# EAGLE design Lighting (EAGLE 9.6.2)
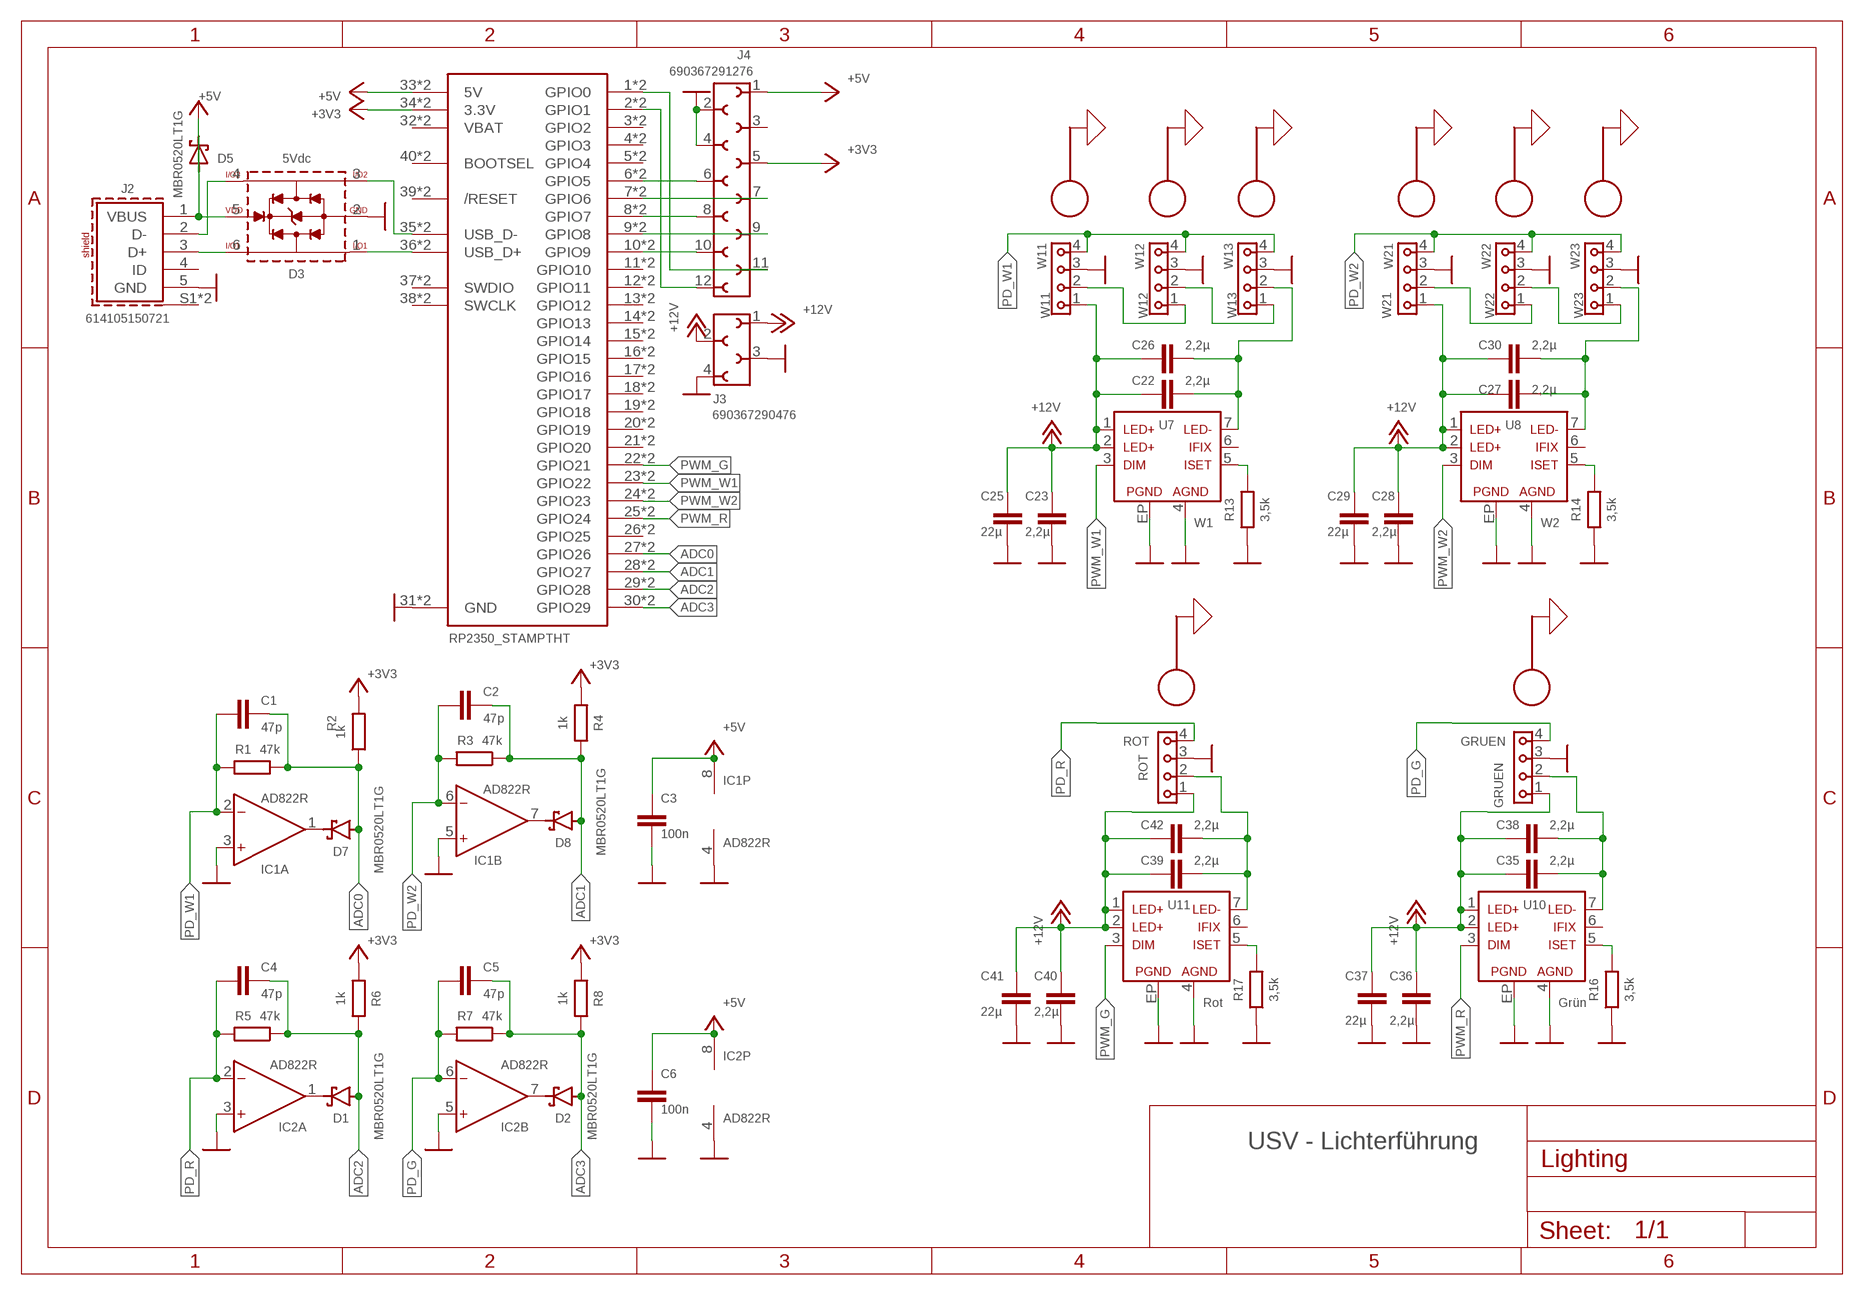
[diagram p0: schematic, sheet 1]

## Parts
C1  47p  C_CHIP-0805(2012-METRIC)  [CAPC2012X110]
C2  47p  C_CHIP-0805(2012-METRIC)  [CAPC2012X110]
C3  100n  C_CHIP-0805(2012-METRIC)  [CAPC2012X110]
C4  47p  C_CHIP-0805(2012-METRIC)  [CAPC2012X110]
C5  47p  C_CHIP-0805(2012-METRIC)  [CAPC2012X110]
C6  100n  C_CHIP-0805(2012-METRIC)  [CAPC2012X110]
C22  2,2µ  C_CHIP-0805(2012-METRIC)  [CAPC2012X110]
C23  2,2µ  C_CHIP-0805(2012-METRIC)  [CAPC2012X110]
C25  22µ  C_CHIP-0805(2012-METRIC)  [CAPC2012X110]
C26  2,2µ  C_CHIP-0805(2012-METRIC)  [CAPC2012X110]
C27  2,2µ  C_CHIP-0805(2012-METRIC)  [CAPC2012X110]
C28  2,2µ  C_CHIP-0805(2012-METRIC)  [CAPC2012X110]
C29  22µ  C_CHIP-0805(2012-METRIC)  [CAPC2012X110]
C30  2,2µ  C_CHIP-0805(2012-METRIC)  [CAPC2012X110]
C35  2,2µ  C_CHIP-0805(2012-METRIC)  [CAPC2012X110]
C36  2,2µ  C_CHIP-0805(2012-METRIC)  [CAPC2012X110]
C37  22µ  C_CHIP-0805(2012-METRIC)  [CAPC2012X110]
C38  2,2µ  C_CHIP-0805(2012-METRIC)  [CAPC2012X110]
C39  2,2µ  C_CHIP-0805(2012-METRIC)  [CAPC2012X110]
C40  2,2µ  C_CHIP-0805(2012-METRIC)  [CAPC2012X110]
C41  22µ  C_CHIP-0805(2012-METRIC)  [CAPC2012X110]
C42  2,2µ  C_CHIP-0805(2012-METRIC)  [CAPC2012X110]
D1  MBR0520LT1G  SCHOTTKY_MBR0520LT1GDO-219  [SODFL3718X115]
D2  MBR0520LT1G  SCHOTTKY_MBR0520LT1GDO-219  [SODFL3718X115]
D3  5Vdc  WE-TVS-HS_SOT563_82400152  [WE-TVS_SOT563]
D5  MBR0520LT1G  SCHOTTKY_MBR0520LT1GDO-219  [SODFL3718X115]
D7  MBR0520LT1G  SCHOTTKY_MBR0520LT1GDO-219  [SODFL3718X115]
D8  MBR0520LT1G  SCHOTTKY_MBR0520LT1GDO-219  [SODFL3718X115]
GRUEN  LED_PLATINE  [LED_PLATINE]
IC1  AD822R  [SO8]
IC2  AD822R  [SO8]
J2  614105150721  [614105150721]
J3  690367290476  [690367290476]
J4  690367291276  [690367291276]
R1  47k  R_CHIP-0805(2012-METRIC)  [RESC2012X65]
R2  1k  R_CHIP-0805(2012-METRIC)  [RESC2012X65]
R3  47k  R_CHIP-0805(2012-METRIC)  [RESC2012X65]
R4  1k  R_CHIP-0805(2012-METRIC)  [RESC2012X65]
R5  47k  R_CHIP-0805(2012-METRIC)  [RESC2012X65]
R6  1k  R_CHIP-0805(2012-METRIC)  [RESC2012X65]
R7  47k  R_CHIP-0805(2012-METRIC)  [RESC2012X65]
R8  1k  R_CHIP-0805(2012-METRIC)  [RESC2012X65]
R13  3,5k  R_CHIP-0805(2012-METRIC)  [RESC2012X65]
R14  3,5k  R_CHIP-0805(2012-METRIC)  [RESC2012X65]
R16  3,5k  R_CHIP-0805(2012-METRIC)  [RESC2012X65]
R17  3,5k  R_CHIP-0805(2012-METRIC)  [RESC2012X65]
ROT  LED_PLATINE  [LED_PLATINE]
U7  W1  MAGI³C-LDHM_172946001  [MAGI³C-LDHM_172946001]
U8  W2  MAGI³C-LDHM_172946001  [MAGI³C-LDHM_172946001]
U10  Grün  MAGI³C-LDHM_172946001  [MAGI³C-LDHM_172946001]
U11  Rot  MAGI³C-LDHM_172946001  [MAGI³C-LDHM_172946001]
U$1  RP2350_STAMPTHT  [RP2XXX_STAMP_TH]
W11  LED_PLATINE  [LED_PLATINE]
W12  LED_PLATINE  [LED_PLATINE]
W13  LED_PLATINE  [LED_PLATINE]
W21  LED_PLATINE  [LED_PLATINE]
W22  LED_PLATINE  [LED_PLATINE]
W23  LED_PLATINE  [LED_PLATINE]

## Nets
+3V3: J4.5 R2.2 R4.2 R6.2 R8.2 U$1.34(3.3V) U$1.TH34(3.3V)
+5V: C3.1 C6.1 D5.2(A) IC1.8(P:V+) IC2.8(P:V+) J4.1 U$1.33(5V) U$1.TH33(5V)
+12V: C22.1 C23.1 C25.1 C26.1 C27.1 C28.1 C29.1 C30.1 C35.1 C36.1 C37.1 C38.1 C39.1 C40.1 C41.1 C42.1 GRUEN.1 J3.1 J3.2 ROT.1 U7.1(LED+) U7.2(LED1+) U8.1(LED+) U8.2(LED1+) U10.1(LED+) U10.2(LED1+) U11.1(LED+) U11.2(LED1+) W11.1 W21.1
ADC0: C1.2 D7.2(A) R1.1 R2.1 U$1.27(GPIO26) U$1.TH27(GPIO26)
ADC1: C2.2 D8.2(A) R3.1 R4.1 U$1.28(GPIO27) U$1.TH28(GPIO27)
ADC2: C4.2 D1.2(A) R5.1 R6.1 U$1.29(GPIO28) U$1.TH29(GPIO28)
ADC3: C5.2 D2.2(A) R7.1 R8.1 U$1.30(GPIO29) U$1.TH30(GPIO29)
D+@1: D3.6(I/O3) J2.3(D+)
D-@1: D3.4(I/O4) J2.2(D-)
D_N: D3.3(I/O2) U$1.35(USB_D-) U$1.TH35(USB_D-)
D_P: D3.1(I/O1) U$1.36(USB_D+) U$1.TH36(USB_D+)
GND: C3.2 C6.2 C23.2 C25.2 C28.2 C29.2 C36.2 C37.2 C40.2 C41.2 D3.2(GND) GRUEN.3 IC1.3(A:IN+) IC1.4(P:V-) IC1.5(B:IN+) IC2.3(A:IN+) IC2.4(P:V-) IC2.5(B:IN+) J2.5(GND) J3.3 J3.4 J4.2 J4.4 R13.1 R14.1 R16.1 R17.1 ROT.3 U7.4(AGND) U7.EP(PGND) U8.4(AGND) U8.EP(PGND) U10.4(AGND) U10.EP(PGND) U11.4(AGND) U11.EP(PGND) U$1.31(GND) U$1.TH31(GND) W11.3 W12.3 W13.3 W21.3 W22.3 W23.3
LED-G-: C35.2 C38.2 GRUEN.2 U10.7(LED-)
LED-R-: C39.2 C42.2 ROT.2 U11.7(LED-)
LED-W1-: C22.2 C26.2 U7.7(LED-) W13.2
LED_W2-: C27.2 C30.2 U8.7(LED-) W23.2
N$1: D1.1(C) IC2.1(A:OUT)
N$2: D2.1(C) IC2.7(B:OUT)
N$4: J4.10 U$1.10(GPIO9) U$1.TH10(GPIO9)
N$5: D7.1(C) IC1.1(A:OUT)
N$6: J4.9 U$1.9(GPIO8) U$1.TH9(GPIO8)
N$11: J4.8 U$1.8(GPIO7) U$1.TH8(GPIO7)
N$12: J4.7 U$1.7(GPIO6) U$1.TH7(GPIO6)
N$13: D8.1(C) IC1.7(B:OUT)
N$14: J4.6 U$1.6(GPIO5) U$1.TH6(GPIO5)
N$17: R16.2 U10.5(ISET)
N$18: R17.2 U11.5(ISET)
N$20: R13.2 U7.5(ISET)
N$21: J4.12 U$1.2(GPIO1) U$1.TH2(GPIO1)
N$22: J4.11 U$1.1(GPIO0) U$1.TH1(GPIO0)
N$25: R14.2 U8.5(ISET)
PD_G: C5.1 GRUEN.4 IC2.6(B:IN-) R7.2
PD_R: C4.1 IC2.2(A:IN-) R5.2 ROT.4
PD_W1: C1.1 IC1.2(A:IN-) R1.2 W11.4 W12.4 W13.4
PD_W2: C2.1 IC1.6(B:IN-) R3.2 W21.4 W22.4 W23.4
PWM_G: U11.3(DIM) U$1.22(GPIO21) U$1.TH22(GPIO21)
PWM_R: U10.3(DIM) U$1.25(GPIO24) U$1.TH25(GPIO24)
PWM_W1: U7.3(DIM) U$1.23(GPIO22) U$1.TH23(GPIO22)
PWM_W2: U8.3(DIM) U$1.24(GPIO23) U$1.TH24(GPIO23)
VBUS: D3.5(VDD) D5.1(C) J2.1(VBUS)
W11_W12: W11.2 W12.1
W12_W13: W12.2 W13.1
W21_W22: W21.2 W22.1
W22_W23: W22.2 W23.1
Unconnected: GRUEN.5 J2.4(ID) J2.S1(SHIELD) J2.S2(SHIELD) J4.3 ROT.5 U7.6(IFIX) U8.6(IFIX) U10.6(IFIX) U11.6(IFIX) U$1.3(GPIO2) U$1.4(GPIO3) U$1.5(GPIO4) U$1.11(GPIO10) U$1.12(GPIO11) U$1.13(GPIO12) U$1.14(GPIO13) U$1.15(GPIO14) U$1.16(GPIO15) U$1.17(GPIO16) U$1.18(GPIO17) U$1.19(GPIO18) U$1.20(GPIO19) U$1.21(GPIO20) U$1.26(GPIO25) U$1.37(SWDIO) U$1.38(SWCLK) U$1.39(/RESET) U$1.40(BOOTSEL) U$1.TH3(GPIO2) U$1.TH4(GPIO3) U$1.TH5(GPIO4) U$1.TH11(GPIO10) U$1.TH12(GPIO11) U$1.TH13(GPIO12) U$1.TH14(GPIO13) U$1.TH15(GPIO14) U$1.TH16(GPIO15) U$1.TH17(GPIO16) U$1.TH18(GPIO17) U$1.TH19(GPIO18) U$1.TH20(GPIO19) U$1.TH21(GPIO20) U$1.TH26(GPIO25) U$1.TH37(SWDIO) U$1.TH38(SWCLK) U$1.TH39(/RESET) U$1.TH40(BOOTSEL) W11.5 W12.5 W13.5 W21.5 W22.5 W23.5

## Notes on the sheet
- USV - Lichterführung

## Power pins joined to a net without a drawn wire
VBAT: U$1.32(VBAT) U$1.TH32(VBAT)

## Library data of the parts
C1-C6 C22 C23 C25-C30 C35-C42 = Capacitor:C: Capacitor - Generic; CATEGORY: Capacitor
D1 D2 D5 D7 D8 = diode:SCHOTTKY_: Schottky Diode - Popular parts; CATEGORY: Diode; DESCRIPTION: DIODE SCHOTTKY 20V 500MA SOD123; MANUFACTURER: ON Semiconductor; MPN: MBR0520LT1G; SUB-CATEGORY: Schottky
D3 = Eagle_WE-TVS (rev22a):WE-TVS-HS_SOT563_82400152: WE-TVS TVS Diode – High Speed Series Characteristics Low clamping voltage Sturdy design Very low capacitance Flow Thru Design for a simple layout Rail to Rail protection Epoxy flame resistant UL94-V0 RoHS, REACH and free of halogens Applications Very fast data lines USB 2.0 Ethernet PoE VGA Sim Cards Keypads HS = High Speed <https://www.we-online.com/catalog/media/o14883v209%20Family_WE-TVS_HIGHSPEED.jpg> Details see: https://www.we-online.com/catalog/en/WE-TVS-HS Updated by Ella Wu 2019-07-12 2019 (C) Wurth Elektronik; C-CH: 2pF; CHANNELS: 2+1; DATASHEET-URL: https://www.we-online.com/catalog/datasheet/82400152.pdf; IPEAK: 6A; MOUNT: SMT; PART-NUMBER: 82400152; VBR: 6V
GRUEN ROT W11-W13 W21-W23 = LED_Platine_SMD:LED_PLATINE
IC1 IC2 = analog-devices:AD822: Single-Supply, Rail-to-Rail Low Power FET-Input Op Amp Source: http://www.analog.com/static/imported-files/data_sheets/AD822.pdf; MF: ANALOG DEVICES; MPN: AD822BRZ; OC_FARNELL: 1651303
J2 = Eagle_WR-USB (rev24c):614105150721: WR-COM Micro USB 2.0 Type B Vertical 5 Contacts General Information Operating Temperature -40 °C up to +85 °C Compliance RoHS Durability 10 000 Mating cycles Quality Class 10 000 Mating cycles Connector Type Micro USB Gender Receptacle Type Vertical Electrical Properties IR 1.8 A Working Voltage 30 V (AC) Withstanding Voltage 100 V (AC) Contact Resistance 30 mΩ Material Properties Insulator Material LCP Insulator Flammability Rating UL94 V-0 Color Black Contact Material Copper Alloy Contact Plating Gold Contact Type Stamped Shielding Material Stainless Steel Shielding Plating Matte Tin <https://www.we-online.com/components/media/o72645v209%20Family_WR-COM_Micro-USB-Type-B_Vertical_614105150721.jpg> Details see: www.we-online.com/en/components/products/COM_MICRO_TYPE_B_VERTICAL <www.we-online.com/catalog/COM_MICRO_TYPE_B_VERTICAL/?utm_source=eagle_model&utm_medium=description_link&utm_campaign=eisos_eagle> Updated by Ella 2024-05-21 2024 (C) Würth Elektronik; APPLICATION: Micro USB 2.0; DATASHEET-URL: https://www.we-online.com/redexpert/spec/614105150721?ae; GERDER: Receptacle; INTERFACE-TYPE: Type B; IR: 1.8A; MOUNT: THT; PACKAGING: Tape and Reel; PART-NUMBER: 614105150721; PINS: 5; TYPE: Vertical; WORKING-VOLTAGE: 30V(AC)
J3 = Eagle_WR-MM (rev20b):690367290476: WR-MM Female SMT Connector with Latch & Polarization KIND PROPERTIES: Pitch 2.54 mm Gender:Female MATERIAL PROPERTIES: Insulator Material:PA6T Insulator Flammability Rating UL94 V-0 Insulator Color:Red Contact Material :Phosphor Bronze Contact Plating :Mat Tin over Nickel Contact Type: Stamped GENERAL PROPERTIES: Operating Temperature:-40 °C up to +105 °C Compliance Lead free / RoHS ELECTRICAL PROPERTIES: Working Voltage 100 V (AC) Withstanding Voltage:500 V (AC) Contact Resistance: 10 mΩ Insulation Resistance:1000 MΩ PACKAGING PROPERTIES: cULus Approval:E323964 Packaging :Tape and Reel <https://katalog.we-online.com/media/images/v2/o33161v209%20WR-MiMo_69036729xx76.jpg> Details see: Web 1: https://katalog.we-online.com/en/em/MM_1_27_SMT_FEMALE_CONNECTOR_WITH_LATCH_AND_POLARIZATION_69036729XX76_2 Web2: https://katalog.we-online.com/en/em/MM_1_27_SMT_FEMALE_CONNECTOR_WITH_LATCH_AND_POLARIZATION_69036729XX76 Updated by Yingchun,Shan 2019-10-28 2019 (C) Würth Elektronik; DATASHEET-URL: https://www.we-online.com/catalog/datasheet/690367290476.pdf; GENDER: Female; IR: 1.5A; PACKAGING: Tape and Reel; PART-NUMBER: 690367290476; PINS: 4; PITCH: 2.54; TYPE: Straight
J4 = Eagle_WR-MM (rev20b):690367291276: WR-MM Female SMT Connector with Latch & Polarization KIND PROPERTIES: Pitch 2.54 mm Gender:Female MATERIAL PROPERTIES: Insulator Material:PA6T Insulator Flammability Rating UL94 V-0 Insulator Color:Red Contact Material :Phosphor Bronze Contact Plating :Mat Tin over Nickel Contact Type: Stamped GENERAL PROPERTIES: Operating Temperature:-40 °C up to +105 °C Compliance Lead free / RoHS ELECTRICAL PROPERTIES: Working Voltage 100 V (AC) Withstanding Voltage:500 V (AC) Contact Resistance: 10 mΩ Insulation Resistance:1000 MΩ PACKAGING PROPERTIES: cULus Approval:E323964 Packaging :Tape and Reel <https://katalog.we-online.com/media/images/v2/o33161v209%20WR-MiMo_69036729xx76.jpg> Details see: Web 1: https://katalog.we-online.com/en/em/MM_1_27_SMT_FEMALE_CONNECTOR_WITH_LATCH_AND_POLARIZATION_69036729XX76_2 Web2: https://katalog.we-online.com/en/em/MM_1_27_SMT_FEMALE_CONNECTOR_WITH_LATCH_AND_POLARIZATION_69036729XX76 Updated by Yingchun,Shan 2019-10-28 2019 (C) Würth Elektronik; DATASHEET-URL: https://www.we-online.com/catalog/datasheet/690367291276.pdf; GENDER: Female; IR: 1.5A; PACKAGING: Tape and Reel; PART-NUMBER: 690367291276; PINS: 12; PITCH: 2.54; TYPE: Straight
R1-R8 R13 R14 R16 R17 = Resistor:R: Resistor Fixed - Generic; CATEGORY: Resistor; SUB-CATEGORY: Fixed
U7 U8 U10 U11 = Eagle_MAGIC-LDHM (rev19a):MAGI³C-LDHM_172946001: MagI³C-LDHM LED Step Down High Current Module Characteristics Leaded package for easy manufacturing and prototyping Simple layout PWM and analog dimming supported Adjustable LED current Low conducted and radiated EMI (compliant to EN55015) Applications Indoor lighting: Spot light, down light Outdoor lighting: Street light, security light, tunnel light Outdoor lighting: High-bay light, low-bay light <https://katalog.we-online.de/media/images/v2/o55812v209%20Family_LED-Driver_Module_WE-LDHM_7EP.jpg> Details see: https://katalog.we-online.de/en/pm/MAGIC-LDHM-TOP263-7EP <hhttps://katalog.we-online.de/en/pm/MAGIC-LDHM-TOP263-7EP> Updated by Ella Wu, 2019-09-18 2019 (C) Würth Elektronik; DATASHEET-URL: https://katalog.we-online.de/pm/datasheet/172946001.pdf; I-OUTPUT: 450mA; MOUNT: SMT; PART-NUMBER: 172946001; V-INPUT: 4.5-60V; V-OUTPUT: 4.5-60V
U$1 = rp2xxx_stamp:RP2350_STAMP

## Board
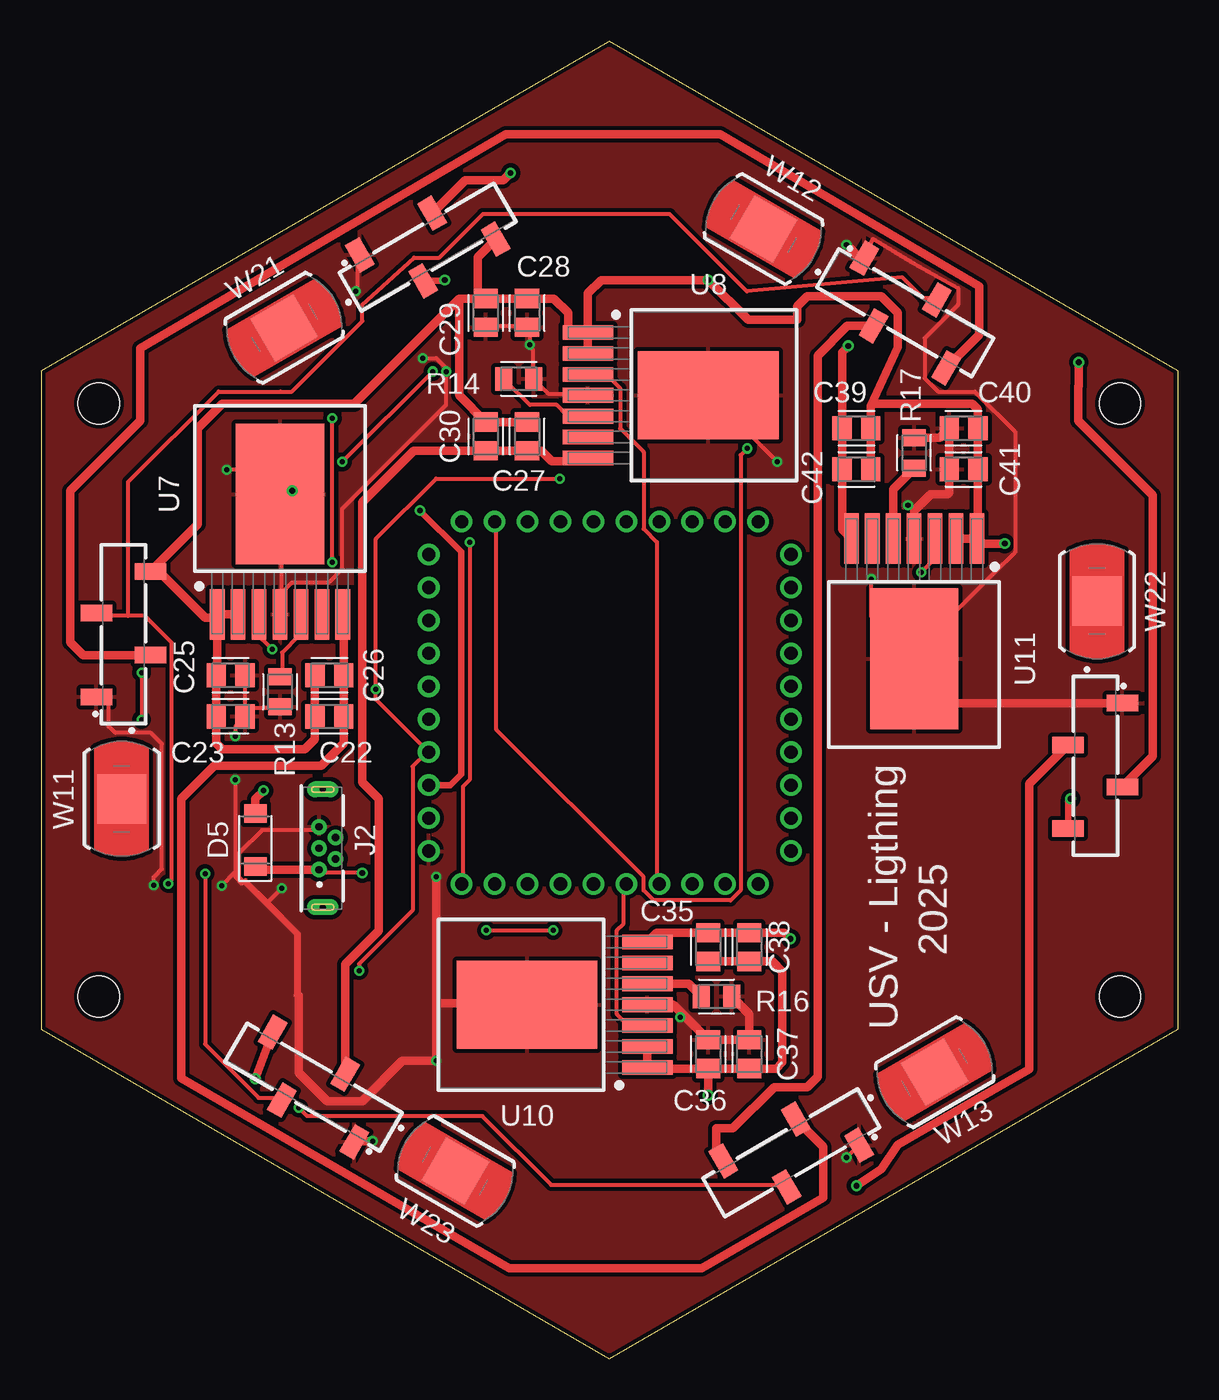
[diagram p1: board, top side]
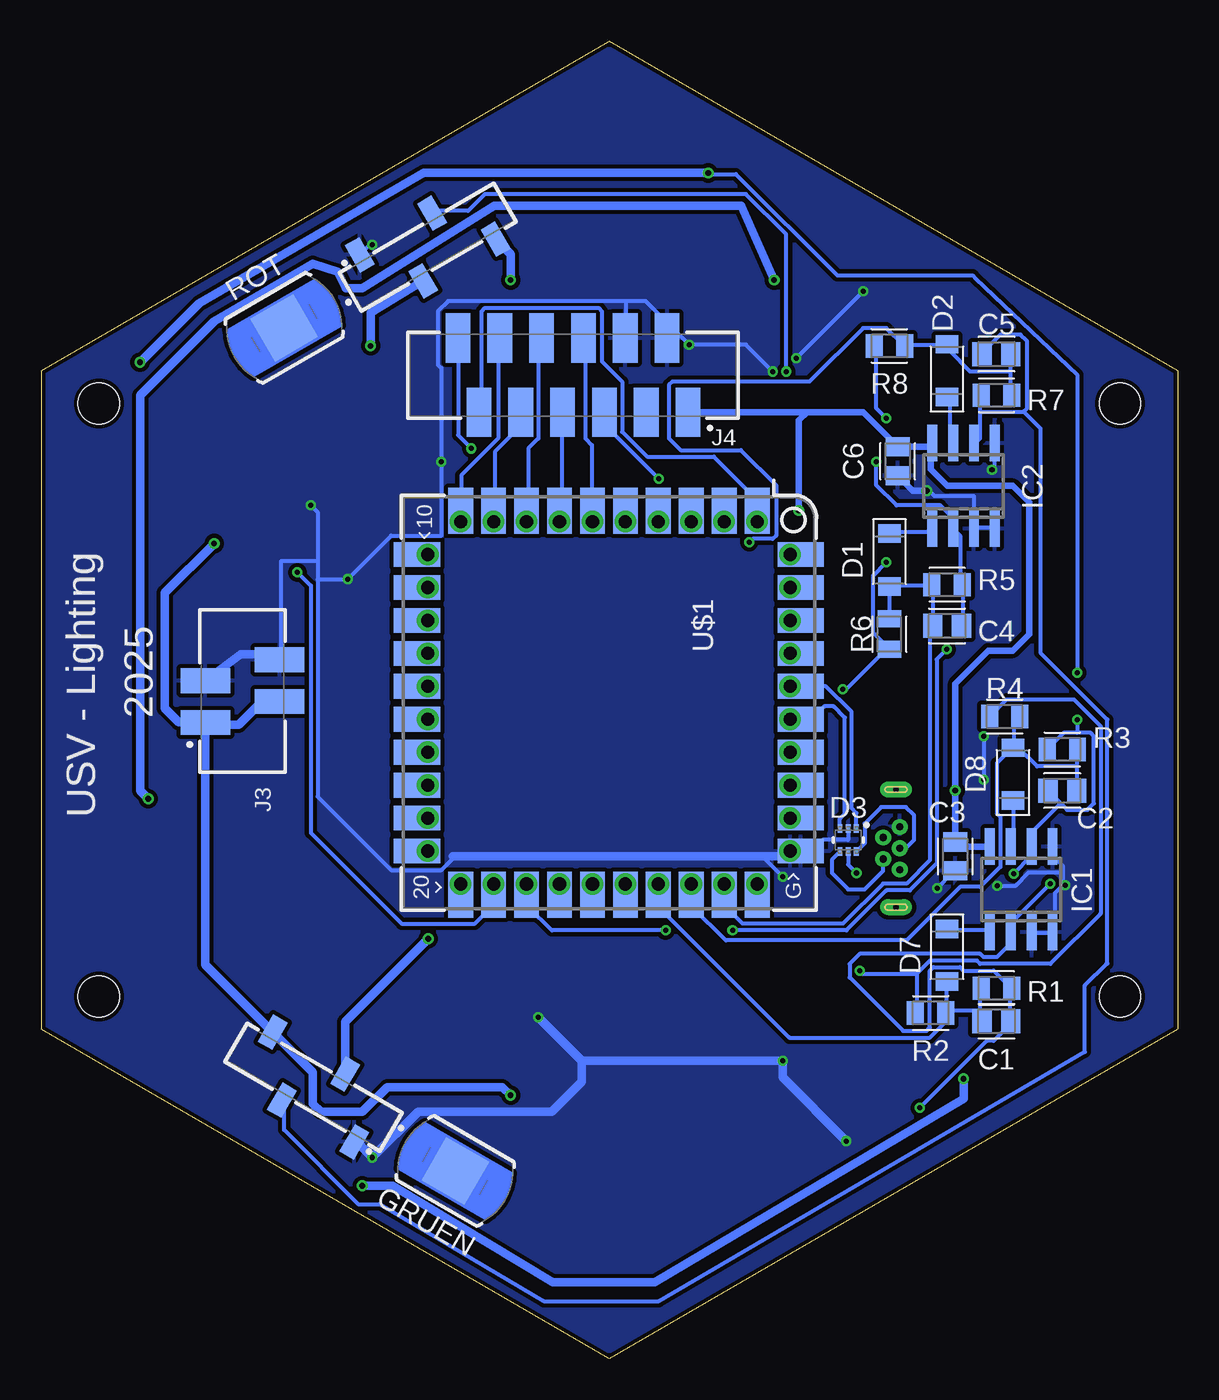
[diagram p2: board, bottom side, seen from below]

Size 69 x 80 mm. Coordinates in mm from the lower left corner, seen from the top.
Outline: 0,60 0,40 0,20 34.5,0 69,20 69,40 69,60 34.5,80 0,60
Copper layers (1*16): Top 0.035mm / dielectric 1.5mm / Bottom 0.035mm
Design rules "Elecrow_2-layer_eagle_rule *": minimum track width 10mil, minimum drill 12mil, track to track 6mil, track to pad 6mil, pad to pad 6mil, via to via 6mil, smd to smd 0mil, copper to edge 10mil, drill to drill 10mil, minimum pad ring 10mil, minimum via ring 6mil, stop-mask expansion 2mil, vias tented up to drill 100mil, thermal gap 10mil
Holes 2.5 mm at 3.5,58 3.5,22 65.5,58 65.5,22

### Footprints (pad centres in the part's own frame; a part is rotated, then mirrored left to right if it is on the bottom)
CAPC2012X110 = smd 1.165 x 1.465: 1 -0.875,0; 2 0.875,0
SODFL3718X115 = smd 1.115 x 1.361: 1 -1.6,0; 2 1.6,0
WE-TVS_SOT563 = smd 0.3 x 0.5: 1 -0.5,-0.7; 2 0,-0.7; 3 0.5,-0.7; 4 0.5,0.7; 5 0,0.7; 6 -0.5,0.7
LED_PLATINE = smd 1 x 1.91: 1 7.81,-1.645; 2 2.73,-1.645; 3 0.19,1.645; 4 5.27,1.645 | smd 3 x 3: 5 -6,0.11
SO8 = smd 0.6 x 2.2: 1 -1.905,-2.6; 2 -0.635,-2.6; 3 0.635,-2.6; 4 1.905,-2.6; 5 1.905,2.6; 6 0.635,2.6; 7 -0.635,2.6; 8 -1.905,2.6
614105150721 = drill 0.44: 1 -1.3,0.125; 2 -0.65,-0.875; 3 0,0.125; 4 0.65,-0.875; 5 1.3,0.125 | drill 0.35 pad 0.97 long: S1 -3.575,-0.095; S2 3.575,-0.095
690367290476 = smd 1.5 x 3: 1 1.905,-2.25; 2 0.635,2.25; 3 -0.635,-2.25; 4 -1.905,2.25
690367291276 = smd 1.5 x 3: 1 6.985,-2.25; 2 5.715,2.25; 3 4.445,-2.25; 4 3.175,2.25; 5 1.905,-2.25; 6 0.635,2.25; 7 -0.635,-2.25; 8 -1.905,2.25; 9 -3.175,-2.25; 10 -4.445,2.25; 11 -5.715,-2.25; 12 -6.985,2.25
RESC2012X65 = smd 1.031 x 1.42: 1 -0.919,0; 2 0.919,0
MAGI³C-LDHM_172946001 = smd 3.06 x 0.89: 1 -7.305,3.81; 2 -7.305,2.54; 3 -7.305,1.27; 4 -7.305,0; 5 -7.305,-1.27; 6 -7.305,-2.54; 7 -7.305,-3.81 | smd 8.54 x 5.35: EP 0,0
RP2XXX_STAMP_TH = smd 2.8 x 1.5: 1 -11.65,9; 2 -11.65,7; 3 -11.65,5; 4 -11.65,3; 5 -11.65,1; 6 -11.65,-1; 7 -11.65,-3; 8 -11.65,-5; 9 -11.65,-7; 10 -11.65,-9; 21 11.65,-9; 22 11.65,-7; 23 11.65,-5; 24 11.65,-3; 25 11.65,-1; 26 11.65,1; 27 11.65,3; 28 11.65,5; 29 11.65,7; 30 11.65,9 | smd 1.5 x 2.8: 11 -9,-11.65; 12 -7,-11.65; 13 -5,-11.65; 14 -3,-11.65; 15 -1,-11.65; 16 1,-11.65; 17 3,-11.65; 18 5,-11.65; 19 7,-11.65; 20 9,-11.65; 31 9,11.65; 32 7,11.65; 33 5,11.65; 34 3,11.65; 35 1,11.65; 36 -1,11.65; 37 -3,11.65; 38 -5,11.65; 39 -7,11.65; 40 -9,11.65 | drill 0.8: TH1 -11,9; TH2 -11,7; TH3 -11,5; TH4 -11,3; TH5 -11,1; TH6 -11,-1; TH7 -11,-3; TH8 -11,-5; TH9 -11,-7; TH10 -11,-9; TH11 -9,-11; TH12 -7,-11; TH13 -5,-11; TH14 -3,-11; TH15 -1,-11; TH16 1,-11; TH17 3,-11; TH18 5,-11; TH19 7,-11; TH20 9,-11; TH21 11,-9; TH22 11,-7; TH23 11,-5; TH24 11,-3; TH25 11,-1; TH26 11,1; TH27 11,3; TH28 11,5; TH29 11,7; TH30 11,9; TH31 9,11; TH32 7,11; TH33 5,11; TH34 3,11; TH35 1,11; TH36 -1,11; TH37 -3,11; TH38 -5,11; TH39 -7,11; TH40 -9,11

### Placement (x,y rotation side)
C1  11,20.5 180 bottom
C2  7,34.5 0 bottom
C3  13.5,30.5 270 bottom
C4  14,44.5 180 bottom
C5  11,61 0 bottom
C6  17,54.5 270 bottom
C22  17.5,39 0 top
C23  11.5,39 0 top
C25  11.5,41.5 0 top
C26  17.5,41.5 0 top
C27  29.5,56 270 top
C28  29.5,63.5 270 top
C29  27,63.5 270 top
C30  27,56 270 top
C35  40.5,25 90 top
C36  40.5,18.5 90 top
C37  43,18.5 90 top
C38  43,25 90 top
C39  49.5,56.5 180 top
C40  56,56.5 180 top
C41  56,54 180 top
C42  49.5,54 180 top
D1  17.5,48.5 270 bottom
D2  14,60 90 bottom
D3  20,31.5 180 bottom
D5  13,31.5 90 top
D7  14,24.5 270 bottom
D8  10,35.5 90 bottom
GRUEN  49,14.5 150 bottom
IC1  9.5,28.5 0 bottom
IC2  13,53 0 bottom
J2  17,31 90 top
J3  56.78,40.54 270 bottom
J4  36.71,59.72 0 bottom
R1  11,22.5 0 bottom
R2  15,21 180 bottom
R3  7,37 180 bottom
R4  10.5,39 180 bottom
R5  14,47 0 bottom
R6  17.5,44 270 bottom
R7  11,58.5 180 bottom
R8  17.5,61.5 180 bottom
R13  14.5,40.5 90 top
R14  29,59.5 180 top
R16  41,22 180 top
R17  53,55 270 top
ROT  49,65.5 30 bottom
U7  14.5,52.5 90 top
U8  40.5,58.5 0 top
U10  29.5,21.5 180 top
U11  53,42.5 270 top
U$1  34.53,39.83 270 bottom
W11  5,40 90 top
W12  49,65.5 330 top
W13  49,14.5 210 top
W21  20,65.5 30 top
W22  64,40 270 top
W23  20,14.5 150 top

### Tracks (layer width: path | path; a pad name or v marks a point on that pad's centre or on a via)
+3V3  (via drill 0.3)
  Top 0.254: v17.68,48.36 v17.68,57.1 | v31.5,53.44 23.98,53.44 20.32,49.78 v20.32,40.64 20.32,40.03 23.37,36.98 U$1.TH34 23.37,36.78 22.55,35.97 22.55,27.23 19.3,23.98 v19.3,23.57
  Bottom 0.254: 15.85,23.37 15.85,21.13 R2.2 | 15.85,23.37 15.04,24.18 12.19,24.18 11.99,23.98 7.72,23.98 4.67,27.03 4.67,38.41 6.3,40.03 10.36,40.03 11.38,39.01 R4.2 | v20.32,40.64 20.12,40.64 17.68,43.08 R6.2 17.68,43.28 18.49,44.09 18.49,47.55 v17.68,48.36 | v17.68,57.1 18.29,57.71 18.29,61.37 R8.2 | U$1.34 22.96,36.98 23.37,36.98 U$1.TH34 | v31.5,53.44 34.75,56.69 34.75,57.3 J4.5 | 15.85,23.37 19.1,23.37 v19.3,23.57
+5V  (via drill 0.35)
  Top 0.406: v23,51.5 25.5,49 25.5,35.5 24.83,34.83 U$1.TH33
  Top 0.508: D5.2 13,34 v13.5,34.5
  Bottom 0.254: U$1.33 22.96,34.95 23.37,34.95 U$1.TH33
  Bottom 0.406: 15,55.5 15.13,55.38 C6.1 19.09,57.47 22,57.47 22.5,57.47 | 15,55.5 IC2.8 | 15,55.5 15,54 14,53 10,53 9,52 9,44 10,43 11.5,43 13.5,41 v13.5,34.5 C3.1 13.22,31.1 IC1.8 | 22.5,57.47 J4.1 | 22.5,57.47 23,56.97 v23,51.5
+12V  (via drill 0.35)
  Top 0.508: W21.1 26.5,66.89 26.5,64.88 C29.1 | U8.1 32.19,62.31 32,62.5 32,63.5 31.12,64.38 C28.1 C29.1 | U8.1 U8.2 | U7.1 10.69,41.56 C25.1 C23.1 10.62,37.38 11,37 16,37 16.62,37.62 C22.1 C26.1 | U7.1 10.49,45 9.96,45 7.14,47.81 W11.1 9.5,50.66 9.5,56.5 11,58 19,58 25.38,64.38 | U7.1 U7.2 | U11.2 U11.1 | U11.1 56.88,49.87 C41.1 C40.1 56.88,57.64 56.51,58 50.5,58 50.38,57.88 | 50.38,57.88 C39.1 C42.1 | U10.2 U10.1 36.87,17.62 C36.1 | C36.1 C37.1 44.62,17.62 45,18 45,23.5 44.38,24.12 C38.1 C35.1 | 25.38,64.38 C29.1 | v58.5,49.5 57.12,49.5 U11.1 | U8.1 33.2,64.69 34,65.5 v40.5,65.5 42.92,63.08 45.92,63.08 45.92,63.92 46.5,64.5 51,64.5 52,63.5 52,61.41 50.38,57.88 | C27.1 C30.1 25.38,58.5 25.38,64.38 | C36.1 v40.5,16
  Bottom 0.406: J3.2 55.59,39.91 | 58.9,38.5 J3.1
  Bottom 0.508: 55.59,39.91 57,38.5 58.9,38.5 | v58.5,49.5 61.5,46.5 61.5,39.5 60.63,38.63 J3.1 59.03,23.92 GRUEN.1 52.5,17.39 52.5,15.5 52,15 49.5,15 48,16.5 41,16.5 v40.5,16 | ROT.1 40.5,67.07 v40.5,65.5
ADC0
  Bottom 0.254: 14.02,21.13 14.02,22.76 D7.2 | 14.02,21.13 R2.1 | 11.99,21.13 11.99,20.52 C1.2 11.99,21.13 | 11.99,21.13 11.99,22.35 R1.1 | 11.99,21.13 14.02,21.13 | 14.02,21.13 R2.1 | U$1.TH27 31.5,28.65 31.5,28.25 U$1.27 31.5,28.04 31.5,27.43 23.57,19.51 15.04,19.51 14.22,20.32 14.22,20.93 R2.1
ADC1
  Bottom 0.254: U$1.TH28 29.67,28.65 29.67,28.25 U$1.28 29.46,28.04 29.46,27.43 27.43,25.4 16.46,25.4 13.21,28.65 11.99,28.65 10.77,29.87 10.77,32.92 10.97,33.12 10.97,36.17 10.16,36.98 D8.2 | D8.2 9.96,37.19 9.96,38.61 9.75,38.81 R4.1 | 6.1,35.97 6.1,34.54 C2.2 | 6.1,35.97 6.1,36.98 R3.1 | 6.1,35.97 8.53,35.97 9.55,36.98 9.96,36.98 D8.2
ADC2
  Bottom 0.254: U$1.TH29 27.64,28.65 27.64,28.25 U$1.29 27.43,28.04 27.43,27.43 26.42,26.42 20.32,26.42 17.88,28.85 16.46,28.85 15.04,30.28 15.04,44.3 C4.2 14.83,44.5 14.83,46.94 R5.1 15.04,46.94 17.48,46.94 D1.2 17.48,46.74 17.48,45.11 R6.1
ADC3  (via drill 0.3)
  Top 0.254: v26.01,49.58 26.01,35.15 25.6,34.75 25.6,28.85 U$1.TH30
  Bottom 0.254: U$1.TH30 25.6,28.65 25.6,28.25 U$1.30 | 10.16,59.94 10.16,60.96 C5.2 | 10.16,59.94 10.16,58.52 R7.1 | 10.16,59.94 12.6,59.94 13.82,61.16 13.82,61.57 D2.2 14.02,61.57 16.46,61.57 R8.1 16.66,61.57 17.68,62.59 19.1,62.59 22.35,59.33 30.68,59.33 30.89,59.13 30.89,55.88 30.18,55.18 26.53,55.18 24.38,53.03 24.38,49.99 24.59,49.78 25.81,49.78 v26.01,49.58
D+@1
  Bottom 0.254: J2.3 16.5,31 16,31.5 16,33 16.5,33.5 18,33.5 19,32.5 19,31.3 D3.6
D-@1
  Bottom 0.254: D3.4 21,30.3 21,29.5 20,28.5 19,28.5 17.88,29.62 J2.2
D_N
  Bottom 0.254: D3.3 20.5,32.79 20.2,33.08 20.2,38.93 20.89,39.61 21.45,39.61 22.23,38.83 U$1.35 22.96,38.81 23.37,38.81 U$1.TH35
D_P
  Bottom 0.254: D3.1 19.5,33.13 19.8,33.43 19.8,39.27 21.35,40.83 U$1.36 22.96,40.84 23.37,40.84 U$1.TH36
GND  (via drill 0.3, 0.35)
  Top 0.254: J2.5 16.87,32.11 13.41,32.11 11.99,30.68 11.99,29.26 15.44,25.81 15.44,22.07 15.56,22.07 15.65,22.07 15.65,25.81 13.74,27.71 | v44.7,54.46 40.64,58.52 U8.EP | v50.39,47.35 50.39,45.11 52.83,42.67 | 52.83,42.67 U11.EP 52.83,42.67 | 52.83,42.67 54.08,43.92 57.78,47.62 59.13,48.97 59.13,56.29 56.69,58.73 54.46,58.73 53.65,59.54 53.65,61.98 55.68,64.01 55.68,65 53,66.5 50.5,68 49.85,66.67 W12.3 | v23.16,60.76 23.98,60.76 24.59,60.15 v24.59,59.94 24.59,57.91 18.29,51.61 18.29,47.95 17.48,47.14 15.24,47.14 14.63,46.53 14.63,45.31 U7.4 14.61,46.67 14.61,52.39 U7.EP | 19.08,13.2 W23.3 | v38.81,20.73 38.98,20.89 | 13.74,27.71 12.39,29.06 12.19,28.85 11.79,29.26 11.79,29.53 | v11.79,35.15 11.79,29.53 | v11.79,37.8 11.79,38.41 12.19,38.81 C23.2 | W11.3 4.1,40.19 4.1,38.4 4.5,38 6.66,38 7.33,37.33 7.33,29.75 6.83,29.25 v6.83,28.75 | v48.9,12.22 49.53,12.86 W13.3 | R13.1 14.45,39.53 12.86,39.53 12.38,39.05 C23.2 | v14.61,28.57 13.81,27.78 13.74,27.71 | C25.2 12.38,41.43 12.38,39.21 C23.2 | 29.37,21.59 U10.EP | v10.95,28.73 11.75,29.53 11.79,29.53 | v15.24,52.7 14.76,52.7 14.61,52.55 U7.EP | v11.27,53.98 13.02,53.98 14.45,52.55 U7.EP | 53,51.5 52.86,51.59 52.7,51.75 v52.63,51.82 | C29.2 27.15,62.71 29.37,62.71 C28.2 29.67,62.59 v29.67,61.57 29.69,61.44 29.84,61.28 29.84,59.53 R14.1 30,59.37 30.8,58.58 33.18,58.58 U8.4 | W21.3 19.21,66.99 19.21,64.93 v19.1,64.82 | 23.97,21.59 23.98,21.59 23.97,21.59
  Top 0.508: U11.4 53,51.5 54,52.5 55,52.5 55.12,52.62 C41.2 C40.2 54.54,55.92 R17.1 | R16.1 43,20.92 C37.2 C36.2 38.98,20.89 38.38,21.5 U10.4 | 23.98,21.59 v23.98,18.09 21.93,18.09 19.49,15.65 17.35,15.65 15.65,17.35 15.65,18.5 15.65,22.07 | 23.98,21.59 v23.98,29.26 | 19.08,13.2 v20.12,13.22 | 23.98,21.59 29.37,21.59 | 49.85,66.67 v48.9,67.63 | W22.3 52.19,39.81 52,40 52,41.84 54.08,43.92
  Bottom 0.254: U$1.31 22.55,30.5 21.55,31.5 20,31.5 D3.2 | 52.22,48.42 52.22,51.41 v52.63,51.82 | 52.22,48.42 52.22,47.31 | 52.22,47.31 52.22,34.14 47.75,29.67 44.7,29.67 44,30.37 44,30.5 | 23.65,31.09 23.37,31.09 23.16,31.29 22.76,31.29 22.32,30.86 22.38,30.8 U$1.31 | 23.65,31.09 23.77,31.09 23.98,31.29 U$1.31 | 33.5,64.21 32.31,64.21 30.56,62.47 | 33.5,64.21 44.3,64.21 44.91,63.6 44.91,60.35 44.7,60.15 v44.7,54.46 44.7,49.99 47.75,49.99 v50.39,47.35 50.48,47.31 52.22,47.31 | 30.56,62.47 v29.67,61.57 26.21,61.57 v24.59,59.94 | v19.1,64.82 v23.16,60.76 | v11.79,37.8 v11.79,35.15 | IC1.3 8.73,25.88 7.62,25.88 IC1.4 7.46,26.04 7.46,28.26 | v6.83,28.75 6.97,28.75 7.46,28.26 | 7.46,28.26 6.99,28.73 6.99,29.53 | 6.99,29.53 6.99,29.93 7.59,30.54 IC1.5 | v14.61,28.57 13.65,29.53 C3.2 | 23.65,31.09 23.65,31.11 23.65,31.09 | 23.65,31.09 23.65,30.96 U$1.TH31 23.86,30.5 | 6.99,29.53 9.05,29.53 9.84,28.73 v10.95,28.73 | IC2.4 11.11,50.48 12.22,50.48 IC2.3 12.38,50.48 12.38,52.39 14.76,52.39 15.08,52.7 v15.24,52.7 | v11.27,53.98 11.11,53.98 11.11,55.56 IC2.5 | 54.86,42.77 J3.4 54.45,42.55 54.45,48.42 52.23,48.42 52.22,48.42 | v48.9,67.63 49.05,67.63 49.53,67.15 ROT.3 | J4.2 30.96,62.07 30.64,62.39 30.56,62.47 | J4.4 33.5,62.07 33.5,64.14 33.5,64.21 | 52.22,47.31 52.23,47.31 52.22,47.31 | 25.22,30.5 v23.98,29.26
  Bottom 0.406: C6.2 16.08,52.7 v15.24,52.7
  Bottom 0.508: v20.12,13.22 23.98,17.09 v23.98,18.09 36.17,18.09 | v38.81,20.73 36.59,18.5 36.17,18.09 | 54.86,42.77 56.89,42.77 J3.3 | GRUEN.3 49.84,13.17 v48.9,12.22 46.12,15 38,15 36.17,16.83 36.17,18.09 | 44,30.5 25.22,30.5 23.86,30.5
  pour Bottom (isolate 0.254): 0,60 34.5,80 69,60 69,20 34.5,0 0,20
  pour Top (isolate 0.254): 0,60 34.5,80 69,60 69,20 34.5,0 0,20
LED-G-  (via drill 0.35)
  Top 0.508: U10.7 37.37,25.88 C35.2 C38.2 45.12,25.88 v45.5,25.5
  Bottom 0.508: v45.5,25.5 50.54,20.46 GRUEN.2
LED-R-  (via drill 0.35)
  Top 0.508: U11.7 48.62,50.37 C42.2 C39.2 48.62,61.12 v49,61.5
  Bottom 0.508: v49,61.5 49,63.5 ROT.2
LED-W1-
  Top 0.508: U7.7 18.38,45.13 C26.2 C22.2 18.38,37.38 17,36 10.5,36 8.52,34.02 8.52,17.03 28.41,5.5 40.09,5.5 47.5,9.79 47.5,12.88 W13.2
LED_W2-
  Top 0.406: C27.2 29.56,55.06
  Top 0.508: W23.2 18.46,23.96 20.5,26 20.5,34 19.5,35 19.5,37 19.5,52 22.62,55.12 C30.2 C27.2 | C27.2 29.56,55.06 | C27.2 30.38,55.12 31,54.5 33.01,54.5 U8.7
N$1
  Bottom 0.254: D1.1 17.48,50.19 15.24,50.19 15.04,50.39 IC2.1
N$2
  Bottom 0.254: D2.1 13.82,58.32 13.82,55.68 IC2.7
N$4
  Bottom 0.254: U$1.TH10 43.69,51 43.69,51.41 U$1.10 43.48,51.61 43.48,53.65 41.25,55.88 41.25,61.77 J4.10
N$5
  Bottom 0.254: D7.1 13.82,26.01 11.58,26.01 IC1.1
N$6
  Bottom 0.254: U$1.TH9 41.66,51 41.66,51.41 U$1.9 41.45,51.61 41.45,55.07 40.03,56.49 40.03,57.3 J4.9
N$11
  Bottom 0.254: U$1.TH8 39.62,51 39.62,51.41 U$1.8 39.42,51.61 39.42,55.27 38.81,55.88 38.81,61.77 J4.8
N$12
  Bottom 0.254: U$1.TH7 37.59,51 37.59,51.41 U$1.7 37.39,51.61 37.39,57.3 J4.7
N$13
  Bottom 0.254: D8.1 9.96,33.73 9.96,31.29 IC1.7
N$14
  Bottom 0.254: U$1.TH6 35.56,51 35.56,51.41 U$1.6 35.56,51.61 35.56,55.47 35.97,55.88 35.97,61.77 J4.6
N$17
  Top 0.508: U10.5 39.31,22.77 R16.2
N$18
  Top 0.508: U11.5 51.73,52.81 R17.2
N$20
  Top 0.254: R13.2 14.63,41.45 14.63,42.88 15.65,43.89 15.65,45.11 U7.5
N$21  (via drill 0.3)
  Top 0.254: v42.88,55.27 42.47,54.86 42.47,28.45 41.86,27.84 37.19,27.84 36.58,28.45 36.58,29.26 27.64,38.2 27.64,50.8 U$1.TH2
  Bottom 0.254: U$1.TH2 27.64,51 27.64,51.41 U$1.2 | v42.88,55.27 43.69,56.08 43.69,61.77 J4.12
N$22
  Bottom 0.254: U$1.TH1 25.6,51 25.6,51.41 U$1.1 25.6,51.61 25.6,52.22 28.15,54.77 32.22,54.77 33.73,56.29 33.73,59.33 34.95,60.55 34.95,63.6 35.15,63.8 42.06,63.8 42.27,63.6 42.27,57.51 J4.11
N$25
  Top 0.254: R14.2 28.25,59.33 29.67,57.91 31.29,57.91 31.9,57.3 33.12,57.3 U8.5
PD_G
  Bottom 0.254: 11.99,57.51 11.99,55.88 12.19,55.68 IC2.6 | 11.99,57.51 11.99,58.32 R7.2 | 9.35,57.51 9.14,57.71 9.14,61.77 9.55,62.18 10.77,62.18 11.79,61.16 C5.1 | 11.99,57.51 9.35,57.51 | 9.35,57.51 8.33,56.49 8.33,42.88 4.27,38.81 4.27,24 4.31,24 5.63,22.68 5.63,18.63 31.5,3.5 38.5,3.5 48.45,9.39 49.75,9.39 54.25,13.9 54.25,15.16 54.25,15.65 GRUEN.4
PD_R  (via drill 0.3)
  Top 0.254: v18.29,54.46 v23.77,59.94
  Bottom 0.254: C4.1 13.01,44.5 13.01,46.94 R5.2 13.21,47.14 13.21,49.99 13.61,50.39 IC2.2 13.82,50.6 13.82,51.21 14.43,51.82 17.07,51.82 18.29,53.03 v18.29,54.46 | v23.77,59.94 23.77,68.28 26.21,70.71 42.06,70.71 43.08,69.7 45.11,69.7 ROT.4
PD_W1  (via drill 0.3)
  Top 0.254: v15.65,15.24 16.15,14.74 26.79,14.74 30.96,10.57 45.11,10.57 W13.4 | 5.28,45.11 6.3,45.11 7.92,43.48 7.92,29.06 v7.72,28.85 | 5.28,45.11 3.45,45.11 W11.4 | 5.28,45.11 5.28,53.24 10.77,58.73 14.52,58.73 15.22,58.73 19.5,63 19.5,64 22.65,66.85 24.18,66.85 26.82,69.49 38.16,69.49 42.85,64.81 52.29,65.66 53.53,64.41 54.25,64.41 W12.4
  Bottom 0.254: v15.65,15.24 11.58,19.3 11.18,19.3 10.16,20.32 C1.1 10.16,20.52 10.16,22.35 R1.2 10.16,22.55 11.18,23.57 13.01,23.57 13.21,23.77 14.83,23.77 15.04,23.57 15.04,20.12 15.24,19.91 16.66,19.91 19.91,23.16 19.91,23.98 19.3,24.59 11.99,24.59 11.79,24.38 10.97,24.38 10.16,25.2 10.16,25.81 IC1.2 9.96,26.01 9.96,26.62 v7.72,28.85
PD_W2  (via drill 0.3, 0.35)
  Top 0.254: v9.96,29.46 9.96,19.1 13.21,15.85 14.43,15.85 W23.4 | v6.1,41.66 v6.1,38.81
  Top 0.508: W22.4 67.5,36.59 67.5,37.5 67.5,52.44 62.98,56.96 62.98,59.04 63,59.06 v63,60.5 | v28.5,72 28.06,71.56 25.74,71.56 W21.4
  Bottom 0.254: 6.1,38 5.28,38 5.08,37.8 5.08,33.73 5.49,33.33 6.71,33.33 7.11,33.73 | 6.1,38 6.91,38 7.72,37.19 R3.2 | 7.11,33.73 7.72,34.34 C2.1 | v9.96,29.46 8.94,30.48 8.94,31.09 IC1.6 8.74,31.29 8.74,32.11 7.11,33.73 | v6.1,38.81 6.1,38 | v6.1,41.66 6.1,59.75 12.28,65.6 12.44,65.78 20.66,65.78 26.82,71.93 28.45,71.93 v28.5,72
  Bottom 0.508: v63,60.5 59.41,64.09 45.77,72 v28.5,72
PWM_G  (via drill 0.3)
  Top 0.254: v53.44,47.75 54.25,48.56 54.25,49.78 U11.3
  Bottom 0.254: U$1.TH22 41.66,28.65 41.66,28.25 U$1.22 41.66,28.04 41.66,27.43 42.67,26.42 47.11,26.42 52.63,31.93 52.63,46.94 v53.44,47.75
PWM_R
  Top 0.254: U$1.TH25 35.36,28.65 35.36,26.42 34.95,26.01 34.95,20.93 35.56,20.32 36.78,20.32 U10.3
  Bottom 0.254: U$1.TH25 35.56,28.65 35.56,28.25 U$1.25
PWM_W1  (via drill 0.3)
  Top 0.254: v27.03,26.01 v31.09,26.01 | v14.02,43.08 13.41,43.69 13.41,45.11 U7.3
  Bottom 0.254: U$1.TH23 39.62,28.65 39.62,28.25 U$1.23 39.42,28.04 39.42,27.43 38,26.01 v31.09,26.01 | v27.03,26.01 20.12,26.01 17.68,28.45 16.26,28.45 14.63,30.07 14.63,42.47 v14.02,43.08
PWM_W2
  Top 0.254: U$1.TH24 37.39,28.85 37.39,49.58 36.58,50.39 36.58,55.07 35.15,56.49 35.15,58.93 34.34,59.74 33.33,59.74 U8.3
  Bottom 0.254: U$1.TH24 37.59,28.65 37.59,28.25 U$1.24
VBAT
  Bottom 0.254: U$1.TH32 23.37,32.92 22.96,32.92 U$1.32
VBUS  (via drill 0.35)
  Top 0.254: J2.1 17.07,29.5 v19.5,29.5
  Top 0.508: J2.1 13.2,29.7 D5.1
  Bottom 0.254: D3.5 20,30 v19.5,29.5
W11_W12
  Top 0.508: W11.2 2.54,42.73 1.77,43.5 1.77,52.71 6.02,56.96 6.02,61.35 28.21,74.36 33.64,74.36 41.24,74.36 56.94,65.12 56.94,62.17 W12.1
W12_W13
  Top 0.508: W12.2 48.95,62.71 47.14,60.9 47.14,17.14 46.5,16.5 44.5,16.5 42,14 41,14 41,12.43 W13.1
W21_W22  (via drill 0.35)
  Top 0.406: W22.1 62.35,33.85 v62.5,34 | v24.5,65.5 24.44,65.44 W21.2
  Bottom 0.508: v62.5,34 62.98,34.48 62.98,58.5 58.5,63 52.5,66.5 51,66 50.5,65 49.5,65 41.5,70 26.5,70 v24.5,65.5
W22_W23  (via drill 0.35)
  Top 0.508: W23.1 v13,17 | W22.2 60,34.91 60,17.57 53.17,13.67 52,13 51,11.5 v49.5,10.5
  Bottom 0.508: v49.5,10.5 47.66,10.5 37.94,4.66 31.75,4.66 13,15.8 v13,17

### Text on the board
tNames: 2025 | USV - Ligthing
bNames: USV - Lighting | 2025